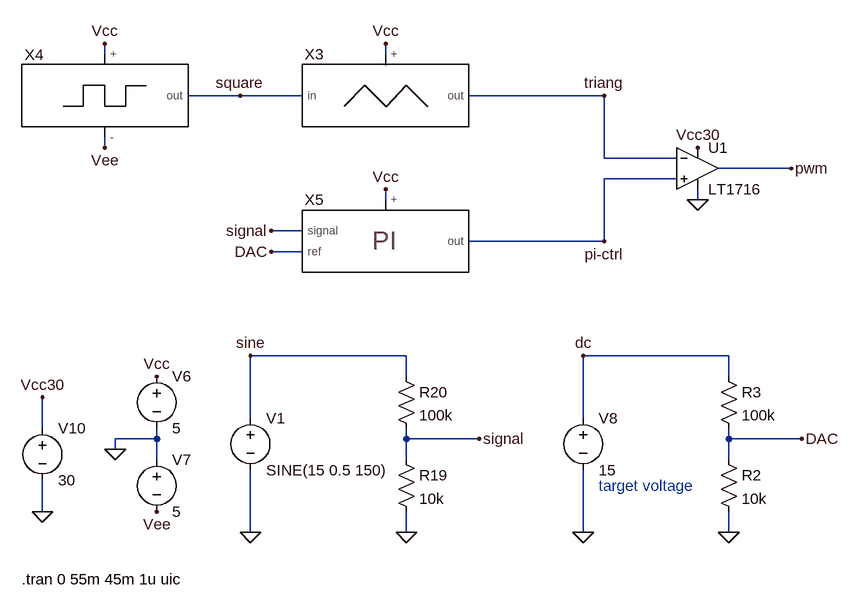
[diagram p0: schematic PI_Regler_Simulation.asc]
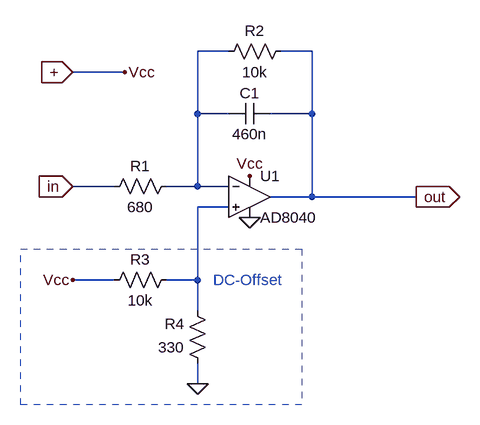
[diagram p1: sub-circuit triangular-wave_generator.asc]
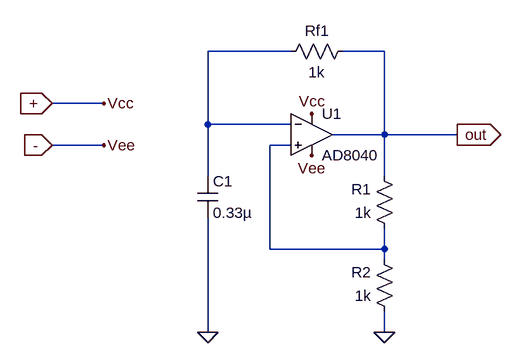
[diagram p2: sub-circuit square-wave_generator.asc]
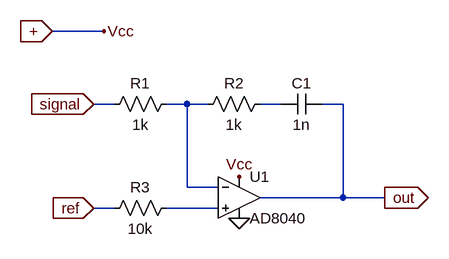
[diagram p3: sub-circuit pi-ctrl.asc]
PI_Regler_Simulation.asc, the LTspice schematic file:
Version 4
SHEET 1 3848 2500
WIRE -3920 -1920 -3920 -1936
WIRE -3488 -1920 -3488 -1936
WIRE -3712 -1856 -3792 -1856
WIRE -3616 -1856 -3712 -1856
WIRE -3152 -1856 -3360 -1856
WIRE -3920 -1776 -3920 -1792
WIRE -3152 -1760 -3152 -1856
WIRE -3040 -1760 -3152 -1760
WIRE -2864 -1744 -2976 -1744
WIRE -3040 -1728 -3152 -1728
WIRE -3488 -1696 -3488 -1712
WIRE -3008 -1696 -3008 -1712
WIRE -3616 -1648 -3664 -1648
WIRE -3152 -1632 -3152 -1728
WIRE -3152 -1632 -3360 -1632
WIRE -3616 -1616 -3664 -1616
WIRE -3456 -1456 -3696 -1456
WIRE -2960 -1456 -3184 -1456
WIRE -3456 -1424 -3456 -1456
WIRE -2960 -1424 -2960 -1456
WIRE -3696 -1360 -3696 -1456
WIRE -3184 -1360 -3184 -1456
WIRE -4016 -1344 -4016 -1392
WIRE -3840 -1328 -3840 -1344
WIRE -3840 -1328 -3904 -1328
WIRE -3456 -1328 -3456 -1344
WIRE -3344 -1328 -3456 -1328
WIRE -2960 -1328 -2960 -1344
WIRE -2848 -1328 -2960 -1328
WIRE -3904 -1312 -3904 -1328
WIRE -3840 -1296 -3840 -1328
WIRE -3456 -1296 -3456 -1328
WIRE -2960 -1296 -2960 -1328
WIRE -4016 -1216 -4016 -1264
WIRE -3696 -1184 -3696 -1280
WIRE -3456 -1184 -3456 -1216
WIRE -3184 -1184 -3184 -1280
WIRE -2960 -1184 -2960 -1216
FLAG -3456 -1184 0
FLAG -3696 -1184 0
FLAG -3904 -1312 0
FLAG -3840 -1216 Vee
FLAG -3840 -1424 Vcc
FLAG -4016 -1216 0
FLAG -4016 -1392 Vcc30
FLAG -2864 -1744 pwm
FLAG -3008 -1696 0
FLAG -3008 -1776 Vcc30
FLAG -3488 -1936 Vcc
FLAG -3920 -1936 Vcc
FLAG -3920 -1776 Vee
FLAG -3664 -1648 signal
FLAG -3664 -1616 DAC
FLAG -3488 -1712 Vcc
FLAG -3712 -1856 square
FLAG -3152 -1856 triang
FLAG -3152 -1632 pi-ctrl
FLAG -3344 -1328 signal
FLAG -3184 -1184 0
FLAG -2960 -1184 0
FLAG -2848 -1328 DAC
FLAG -3696 -1456 sine
FLAG -3184 -1456 dc
SYMBOL res -3472 -1312 R0
SYMATTR InstName R19
SYMATTR Value 10k
SYMBOL res -3472 -1440 R0
SYMATTR InstName R20
SYMATTR Value 100k
SYMBOL voltage -3840 -1440 R0
WINDOW 123 0 0 Left 0
WINDOW 39 0 0 Left 0
SYMATTR InstName V6
SYMATTR Value 5
SYMBOL voltage -3840 -1312 R0
WINDOW 123 0 0 Left 0
WINDOW 39 0 0 Left 0
SYMATTR InstName V7
SYMATTR Value 5
SYMBOL voltage -4016 -1360 R0
SYMATTR InstName V10
SYMATTR Value 30
SYMBOL Comparators\\LT1716 -3008 -1744 R0
SYMATTR InstName U1
SYMBOL triangular-wave_generator -3472 -1856 R0
WINDOW 0 -126 -48 Bottom 2
SYMATTR InstName X3
SYMBOL square-wave_generator -3920 -1856 R0
WINDOW 0 -109 -47 Bottom 2
SYMATTR InstName X4
SYMBOL pi-ctrl -3440 -1616 R0
WINDOW 0 -158 -64 Bottom 2
SYMATTR InstName X5
SYMBOL voltage -3184 -1376 R0
WINDOW 123 0 0 Left 0
WINDOW 39 0 0 Left 0
SYMATTR InstName V8
SYMATTR Value 15
SYMBOL res -2976 -1312 R0
SYMATTR InstName R2
SYMATTR Value 10k
SYMBOL res -2976 -1440 R0
SYMATTR InstName R3
SYMATTR Value 100k
SYMBOL voltage -3696 -1376 R0
WINDOW 123 0 0 Left 0
WINDOW 39 0 0 Left 0
SYMATTR InstName V1
SYMATTR Value SINE(15 0.5 150)
TEXT -4048 -1112 Left 2 !.tran 0 55m 45m 1u uic
TEXT -3160 -1256 Left 2 ;target voltage

triangular-wave_generator.asc, the sub-circuit schematic file:
Version 4
SHEET 1 880 692
WIRE -128 16 -176 16
WIRE 0 16 -48 16
WIRE -288 48 -368 48
WIRE -176 112 -176 16
WIRE -128 112 -176 112
WIRE 0 112 0 16
WIRE 0 112 -64 112
WIRE -304 224 -368 224
WIRE -176 224 -176 112
WIRE -176 224 -224 224
WIRE -128 224 -176 224
WIRE 0 240 0 112
WIRE 0 240 -64 240
WIRE 160 240 0 240
WIRE -128 256 -176 256
WIRE -304 368 -368 368
WIRE -176 368 -176 256
WIRE -176 368 -224 368
WIRE -176 416 -176 368
WIRE -176 528 -176 496
FLAG -96 208 Vcc
FLAG -368 224 in
IOPIN -368 224 In
FLAG -96 272 0
FLAG 160 240 out
IOPIN 160 240 Out
FLAG -368 368 Vcc
FLAG -176 528 0
FLAG -288 48 Vcc
FLAG -368 48 +
IOPIN -368 48 In
SYMBOL res -320 240 R270
WINDOW 0 32 56 VTop 2
WINDOW 3 0 56 VBottom 2
SYMATTR InstName R1
SYMATTR Value 680
SYMBOL cap -64 96 R90
WINDOW 0 0 32 VBottom 2
WINDOW 3 32 32 VTop 2
SYMATTR InstName C1
SYMATTR Value 460n
SYMBOL res -32 0 R90
WINDOW 0 0 56 VBottom 2
WINDOW 3 32 56 VTop 2
SYMATTR InstName R2
SYMATTR Value 10k
SYMBOL Opamps\\AD8040 -96 176 R0
SYMATTR InstName U1
SYMBOL res -208 352 R90
WINDOW 0 0 56 VBottom 2
WINDOW 3 32 56 VTop 2
SYMATTR InstName R3
SYMATTR Value 10k
SYMBOL res -160 512 R180
WINDOW 0 36 76 Left 2
WINDOW 3 36 40 Left 2
SYMATTR InstName R4
SYMATTR Value 330
TEXT -152 368 Left 2 ;DC-Offset
RECTANGLE Normal -16 560 -448 320 2

square-wave_generator.asc, the sub-circuit schematic file:
Version 4
SHEET 1 880 852
WIRE -320 -160 -448 -160
WIRE -176 -160 -240 -160
WIRE -608 -80 -688 -80
WIRE -448 -48 -448 -160
WIRE -320 -48 -448 -48
WIRE -176 -32 -176 -160
WIRE -176 -32 -256 -32
WIRE -64 -32 -176 -32
WIRE -608 -16 -688 -16
WIRE -320 -16 -352 -16
WIRE -448 32 -448 -48
WIRE -176 32 -176 -32
WIRE -352 144 -352 -16
WIRE -176 144 -176 112
WIRE -176 144 -352 144
WIRE -176 160 -176 144
WIRE -448 272 -448 96
WIRE -176 272 -176 240
FLAG -288 -64 Vcc
FLAG -448 272 0
FLAG -176 272 0
FLAG -64 -32 out
IOPIN -64 -32 Out
FLAG -288 0 Vee
FLAG -608 -80 Vcc
FLAG -608 -16 Vee
FLAG -688 -80 +
IOPIN -688 -80 In
FLAG -688 -16 -
IOPIN -688 -16 In
SYMBOL cap -464 32 R0
SYMATTR InstName C1
SYMATTR Value 0.33µ
SYMBOL res -224 -176 R90
WINDOW 0 0 56 VBottom 2
WINDOW 3 32 56 VTop 2
SYMATTR InstName Rf1
SYMATTR Value 1k
SYMBOL res -160 128 R180
WINDOW 0 36 76 Left 2
WINDOW 3 36 40 Left 2
SYMATTR InstName R1
SYMATTR Value 1k
SYMBOL res -160 256 R180
WINDOW 0 36 76 Left 2
WINDOW 3 36 40 Left 2
SYMATTR InstName R2
SYMATTR Value 1k
SYMBOL Opamps\\AD8040 -288 -96 R0
SYMATTR InstName U1

pi-ctrl.asc, the sub-circuit schematic file:
Version 4
SHEET 1 880 680
WIRE -96 -144 -176 -144
WIRE -80 -32 -112 -32
WIRE 32 -32 0 -32
WIRE 64 -32 32 -32
WIRE 176 -32 144 -32
WIRE 272 -32 240 -32
WIRE 32 96 32 -32
WIRE 80 96 32 96
WIRE 272 112 272 -32
WIRE 272 112 144 112
WIRE 336 112 272 112
WIRE -80 128 -112 128
WIRE 80 128 0 128
FLAG 336 112 out
IOPIN 336 112 Out
FLAG 112 80 Vcc
FLAG -112 -32 signal
IOPIN -112 -32 In
FLAG 112 144 0
FLAG -112 128 ref
IOPIN -112 128 In
FLAG -96 -144 Vcc
FLAG -176 -144 +
IOPIN -176 -144 In
SYMBOL res 16 -48 R90
WINDOW 0 0 56 VBottom 2
WINDOW 3 32 56 VTop 2
SYMATTR InstName R1
SYMATTR Value 1k
SYMBOL res 160 -48 R90
WINDOW 0 0 56 VBottom 2
WINDOW 3 32 56 VTop 2
SYMATTR InstName R2
SYMATTR Value 1k
SYMBOL cap 240 -48 R90
WINDOW 0 0 32 VBottom 2
WINDOW 3 32 32 VTop 2
SYMATTR InstName C1
SYMATTR Value 1n
SYMBOL Opamps\\AD8040 112 48 R0
SYMATTR InstName U1
SYMBOL res 16 112 R90
WINDOW 0 0 56 VBottom 2
WINDOW 3 32 56 VTop 2
SYMATTR InstName R3
SYMATTR Value 10k

The netlist it stands for:
* PI_Regler_Simulation.asc
R19 signal 0 10k
R20 sine signal 100k
V6 Vcc 0 5
V7 0 Vee 5
V10 Vcc30 0 30
XU1 pi-ctrl triang Vcc30 0 pwm LT1716  ; pins In+ In- V+ V- OUT
XX3 triang square Vcc triangular-wave_generator
XX4 Vcc Vee square square-wave_generator
XX5 DAC signal Vcc pi-ctrl pi-ctrl
V8 dc 0 15
R2 DAC 0 10k
R3 dc DAC 100k
V1 sine 0 SINE(15 0.5 150)

* block symbol definitions
.subckt triangular-wave_generator out in +
R1 in N001 680
C1 out N001 460n
R2 out N001 10k
XU1 N002 N001 + 0 out AD8040  ; pins In+ In- V+ V- OUT
R3 N002 + 10k
R4 0 N002 330
* DC-Offset
.ends triangular-wave_generator

.subckt square-wave_generator + - out
C1 N001 0 0.33µ
Rf1 out N001 1k
R1 N002 out 1k
R2 0 N002 1k
XU1 N002 N001 + - out AD8040  ; pins In+ In- V+ V- OUT
.ends square-wave_generator

.subckt pi-ctrl ref signal + out
R1 N001 signal 1k
R2 N002 N001 1k
C1 out N002 1n
XU1 N003 N001 + 0 out AD8040  ; pins In+ In- V+ V- OUT
R3 N003 ref 10k
.ends pi-ctrl

.tran 0 55m 45m 1u uic
* target voltage
.lib LTC1.lib
.backanno
.end